# Altium schematic sheet MX120G.SchDoc
size A4; SheetNumber: 13; SheetTotal: 14
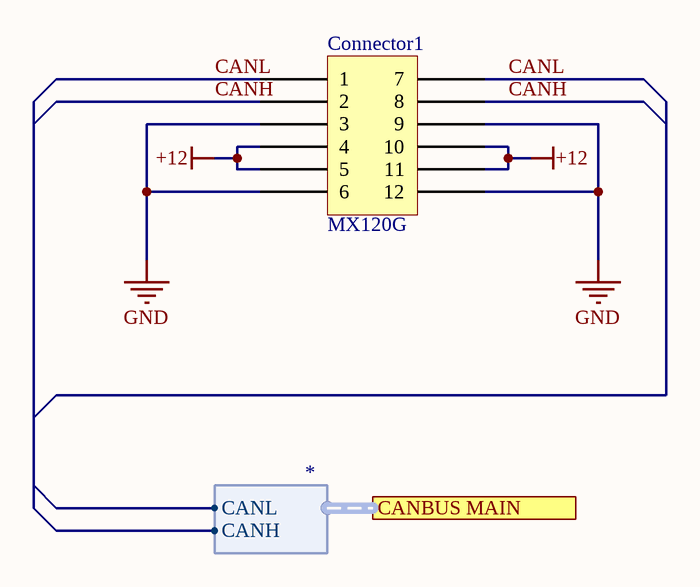
[diagram p0: MX120G.SchDoc]

## Parts
Connector1  MX120G  [MX120G]

## Ports
CANBUS MAIN (harness *)

## Harnesses
*: CANH, CANL

## Nets
+12: Connector1.4 Connector1.5 Connector1.10 Connector1.11
GND: Connector1.3 Connector1.6 Connector1.9 Connector1.12
CANH: Connector1.2 Connector1.8
CANL: Connector1.1 Connector1.7

## Library data of the parts
Connector1 = MX120G: MX120G with standard connector layout